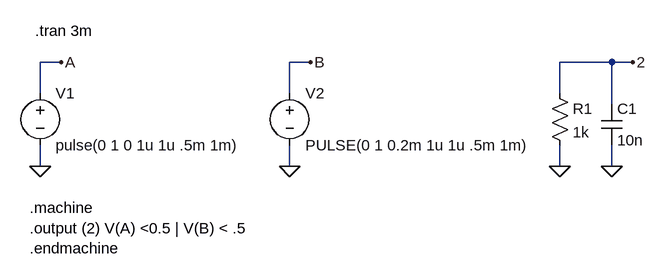
[diagram p0: schematic Fig_3-53_Ex_Machine-1or.asc]
Fig_3-53_Ex_Machine-1or.asc, the LTspice schematic file:
Version 4
SHEET 1 1292 932
WIRE 64 368 32 368
WIRE 448 368 416 368
WIRE 912 368 832 368
WIRE 944 368 912 368
WIRE 32 416 32 368
WIRE 416 416 416 368
WIRE 832 416 832 368
WIRE 912 432 912 368
WIRE 32 528 32 496
WIRE 416 528 416 496
WIRE 832 528 832 496
WIRE 912 528 912 496
FLAG 32 528 0
FLAG 64 368 A
FLAG 832 528 0
FLAG 944 368 2
FLAG 912 528 0
FLAG 416 528 0
FLAG 448 368 B
SYMBOL voltage 32 400 R0
SYMATTR InstName V1
SYMATTR Value pulse(0 1 0 1u 1u .5m 1m)
SYMBOL res 816 400 R0
SYMATTR InstName R1
SYMATTR Value 1k
SYMBOL cap 896 432 R0
SYMATTR InstName C1
SYMATTR Value 10n
SYMBOL voltage 416 400 R0
WINDOW 123 0 0 Left 2
WINDOW 39 0 0 Left 2
SYMATTR InstName V2
SYMATTR Value PULSE(0 1 0.2m 1u 1u .5m 1m)
TEXT 16 592 Left 2 !.machine \n.output (2) V(A) <0.5 | V(B) < .5 \n.endmachine
TEXT 24 320 Left 2 !.tran 3m

The netlist it stands for:
* Fig_3-53_Ex_Machine-1or.asc
V1 A 0 pulse(0 1 0 1u 1u .5m 1m)
R1 2 0 1k
C1 2 0 10n
V2 B 0 PULSE(0 1 0.2m 1u 1u .5m 1m)
.machine
.output (2) V(A) <0.5 | V(B) < .5
.endmachine
.tran 3m
.backanno
.end